# Altium schematic sheet IP2368_BZ_VGLIP1_IP2368_BZ_VGLIP.schdoc.schdoc
size 127 x 101 mm
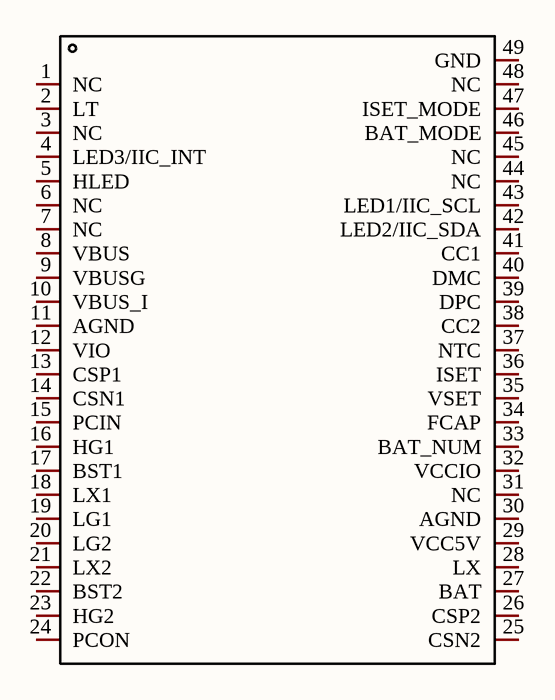
[diagram p0: IP2368_BZ_VGLIP1_IP2368_BZ_VGLIP.schdoc.schdoc]

## Parts
U?  IP2368_BZ_VGLIP  [QFN-48_L7.0-W7.0-P0.50-TL-EP5.4-1]  (value not drawn)

## Nets

Not connected (* = marked no-connect by the designer): U? 1(NC) 2(LT) 3(NC) 4(LED3/IIC_INT) 5(HLED) 6(NC) 7(NC) 8(VBUS) 9(VBUSG) 10(VBUS_I) 11(AGND) 12(VIO) 13(CSP1) 14(CSN1) 15(PCIN) 16(HG1) 17(BST1) 18(LX1) 19(LG1) 20(LG2) 21(LX2) 22(BST2) 23(HG2) 24(PCON) 25(CSN2) 26(CSP2) 27(BAT) 28(LX) 29(VCC5V) 30(AGND) 31(NC) 32(VCCIO) 33(BAT_NUM) 34(FCAP) 35(VSET) 36(ISET) 37(NTC) 38(CC2) 39(DPC) 40(DMC) 41(CC1) 42(LED2/IIC_SDA) 43(LED1/IIC_SCL) 44(NC) 45(NC) 46(BAT_MODE) 47(ISET_MODE) 48(NC) 49(GND)

## Library data of the parts
U? = IP2368_BZ_VGLIP: Manufacturer: INJOINIC(英集芯); Add into BOM: yes; Symbol: IP2368_BZ_VGLIP; Device: IP2368_BZ_VGLIP; Supplier: LCSC; Supplier Part: C7545631; Manufacturer Part: IP2368_BZ_VGLIP; JLCPCB Part Class: Extended Part; LCSC Part Name: IP2368_BZ_VGLIP; Supplier Footprint: QFN-48(7x7); Datasheet: https://atta.szlcsc.com/upload/public/pdf/source/20230829/96F1FEC23EF891AD6B658E36B913DD01.pdf; Convert to PCB: yes